# Altium schematic sheet 01.Driver&DispPanel.SchDoc
size A3
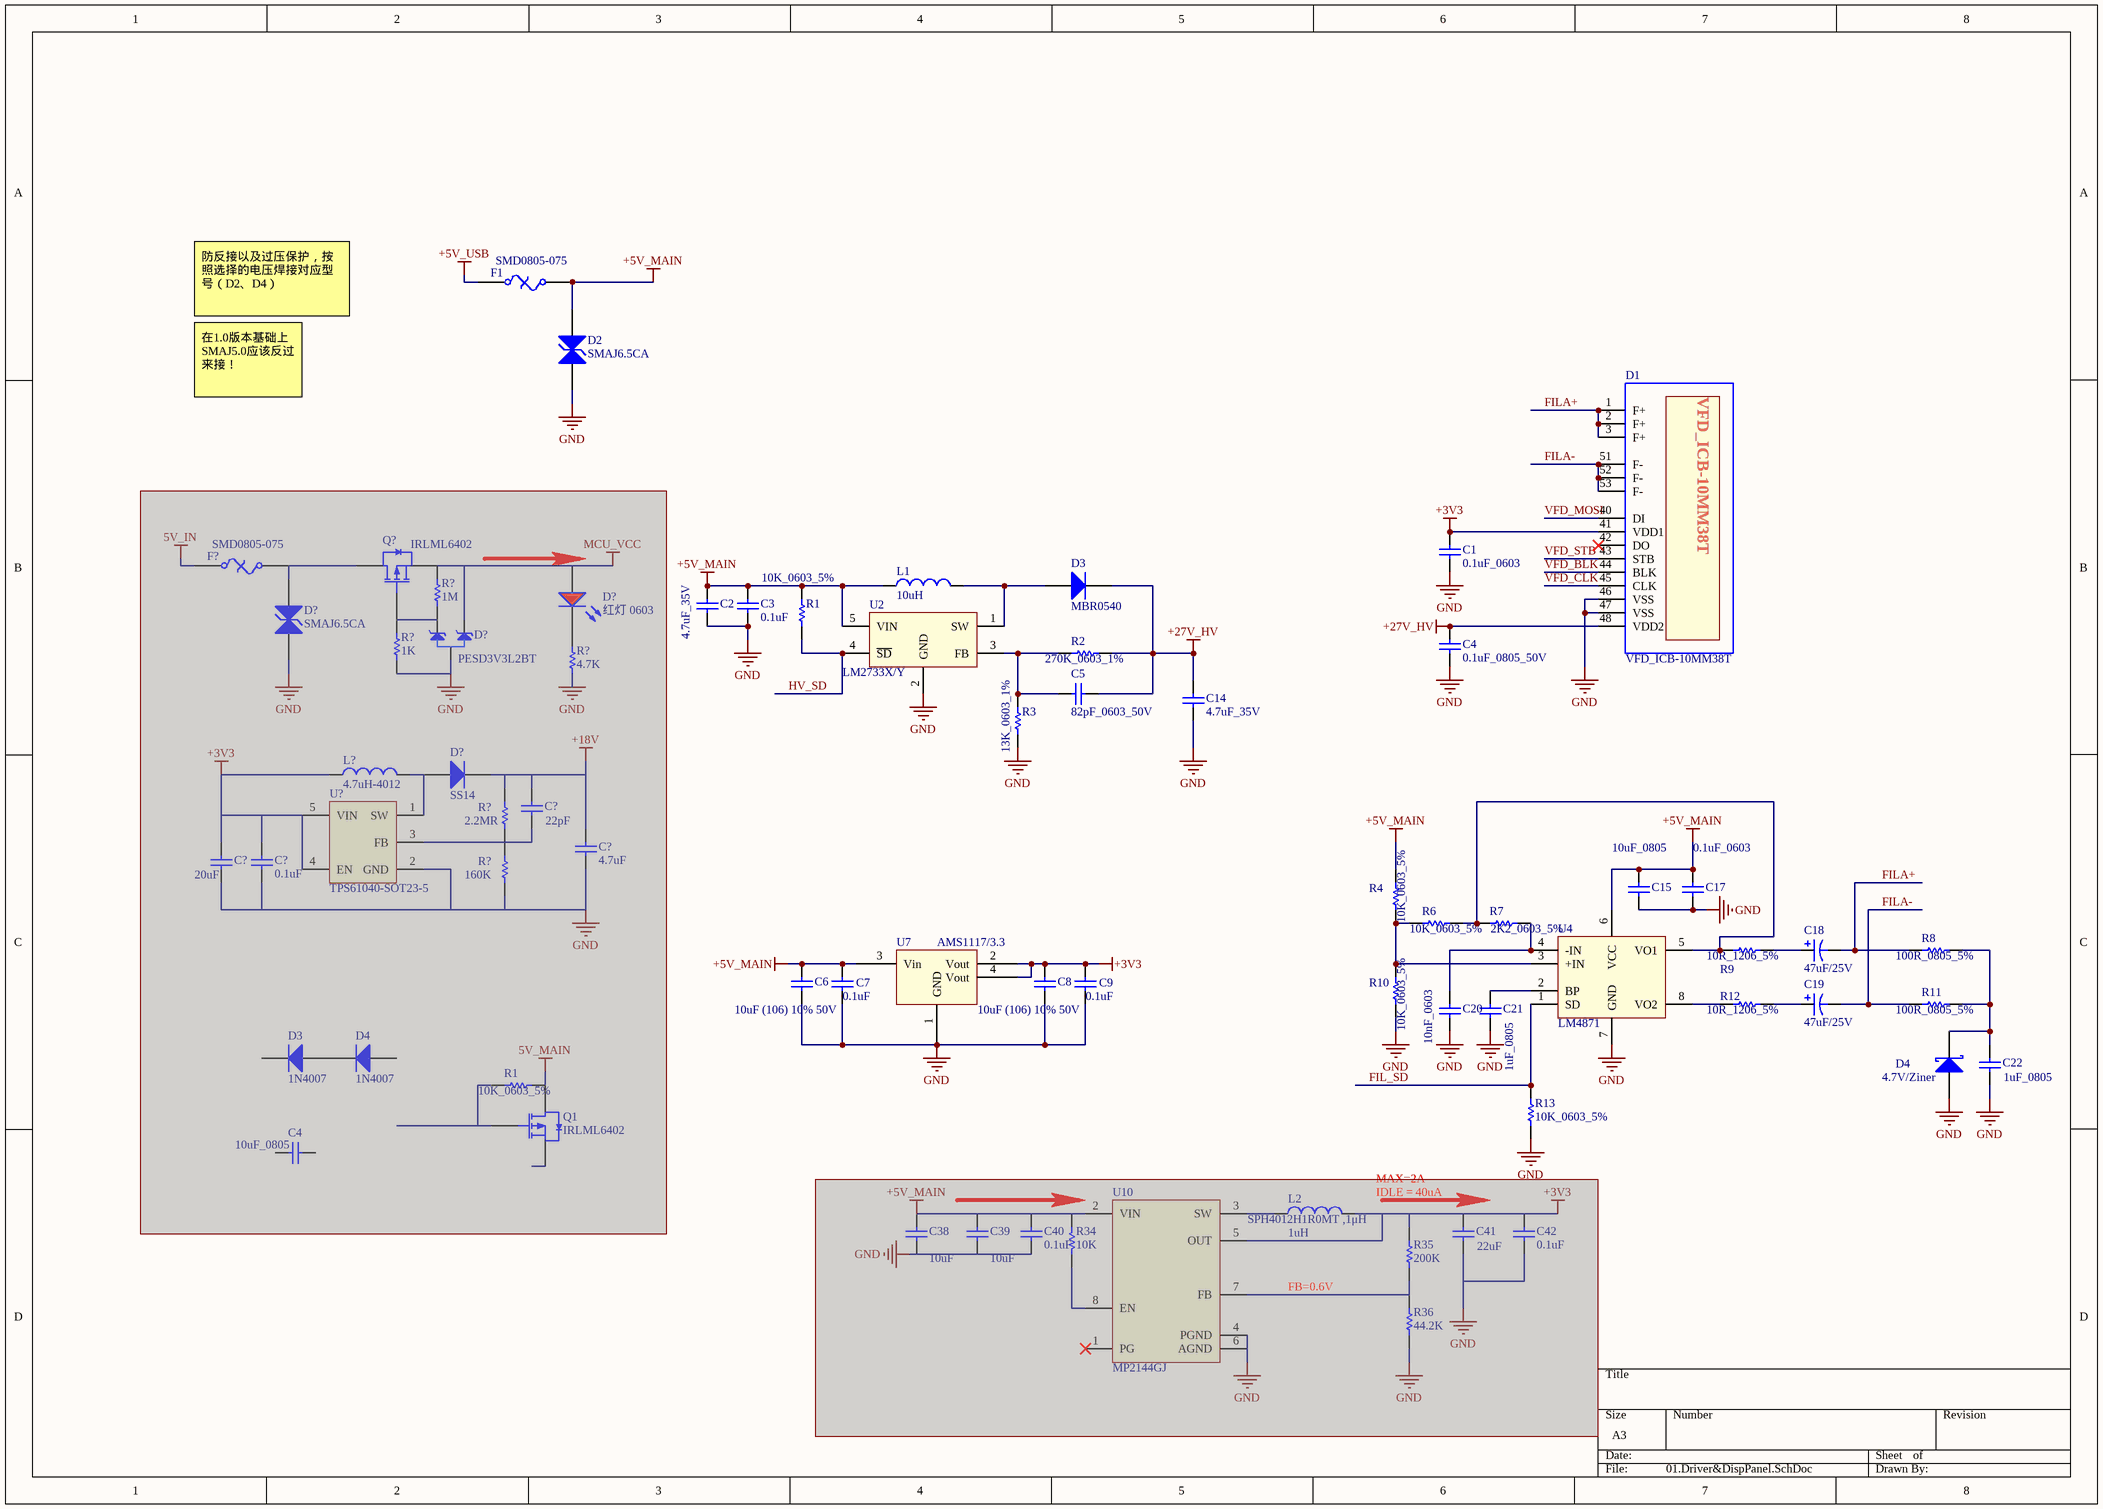
[diagram p0: 01.Driver&DispPanel.SchDoc]

## Parts
(Parts that share a designator on the sheet are numbered #1, #2 ... from top to bottom, then left to right.)
C1  0.1uF_0603  [LC-0603_C]
C2  4.7uF_35V  [LC-0805_C]
C3  0.1uF  [LC-0603_C]
C4#1  0.1uF_0805_50V  [LC-0805_C]
C4#2  10uF_0805  [LC-0603_C]  (masked out: inside a compile mask, not in the netlist)
C5  82pF_0603_50V  [LC-0603_C]
C6  10uF (106) 10% 50V  [LC-1206_C]
C7  value 0.1uF  [LC-0603_C]  (hidden comment: Cap Semi)
C8  10uF (106) 10% 50V  [LC-1206_C]
C9  value 0.1uF  [LC-0603_C]  (hidden comment: Cap Semi)
C14  4.7uF_35V  [LC-0805_C]
C15  10uF_0805  [LC-0805_C]
C17  0.1uF_0603  [LC-0603_C]
C18  47uF/25V  [CAPAE660X540N]
C19  47uF/25V  [CAPAE660X540N]
C20  10nF_0603  [LC-0603_C]
C21  1uF_0805  [LC-0805_C]
C22  1uF_0805  [LC-0805_C]
C38  value 10uF  [LC-0805_C]  (hidden comment: 10uF_0603)  (masked out: inside a compile mask, not in the netlist)
C39  value 10uF  [LC-0805_C]  (hidden comment: 10uF_0603)  (masked out: inside a compile mask, not in the netlist)
C40  value 0.1uF  [LC-0603_C]  (hidden comment: 0.1uF_0402)  (masked out: inside a compile mask, not in the netlist)
C41  value 22uF  [LC-1206_C]  (hidden comment: 10uF_0603)  (masked out: inside a compile mask, not in the netlist)
C42  value 0.1uF  [LC-0603_C]  (hidden comment: 0.1uF_0402)  (masked out: inside a compile mask, not in the netlist)
C?#1  22pF  [LC-0603_C]  (masked out: inside a compile mask, not in the netlist)
C?#2  20uF  [LC-1206_C]  (masked out: inside a compile mask, not in the netlist)
C?#3  4.7uF  [LC-0603_C]  (masked out: inside a compile mask, not in the netlist)
C?#4  0.1uF  [LC-0603_C]  (masked out: inside a compile mask, not in the netlist)
D1  VFD_ICB-10MM38T  [VFD_ICB-10MM38T]
D2  SMAJ6.5CA  [LC-SMA(DO-214AC)_S1]
D3#1  MBR0540  [LC-SOD-123]
D3#2  1N4007  [LC-SOD-123]  (masked out: inside a compile mask, not in the netlist)
D4#1  1N4007  [LC-SOD-123]  (masked out: inside a compile mask, not in the netlist)
D4#2  4.7V/Ziner  [LC-SMA(DO-214AC)_S1]
D?#1  红灯 0603  [LC-0603_LED_S1]  (masked out: inside a compile mask, not in the netlist)
D?#2  PESD3V3L2BT  [LC-SOT-23(SOT-23-3)]  (masked out: inside a compile mask, not in the netlist)
D?#3  SMAJ6.5CA  [LC-SMA(DO-214AC)_S1]  (masked out: inside a compile mask, not in the netlist)
D?#4  SS14  [LC-SOD-123]  (masked out: inside a compile mask, not in the netlist)
F1  SMD0805-075  [LC-0805_L]
F?  SMD0805-075  [LC-0805_L]  (masked out: inside a compile mask, not in the netlist)
L1  10uH  [VLS4012E]
L2  SPH4012H1R0MT ,1μH  value 1uH  [VLS4012E]  (masked out: inside a compile mask, not in the netlist)
L?  4.7uH-4012  [VLS4012E]  (masked out: inside a compile mask, not in the netlist)
Q1  IRLML6402  [LC-SOT-23-3L]  (masked out: inside a compile mask, not in the netlist)
Q?  IRLML6402  [LC-SOT-23-3L]  (masked out: inside a compile mask, not in the netlist)
R1#1  10K_0603_5%  [LC-0603_R]
R1#2  10K_0603_5%  [LC-0603_R]  (masked out: inside a compile mask, not in the netlist)
R2  270K_0603_1%  [LC-0603_R]
R3  13K_0603_1%  [LC-0603_R]
R4  10K_0603_5%  [LC-0603_R]
R6  10K_0603_5%  [LC-0603_R]
R7  2K2_0603_5%  [LC-0603_R]
R8  100R_0805_5%  [LC-0805_R]
R9  10R_1206_5%  [LC-1206_R]
R10  10K_0603_5%  [LC-0603_R]
R11  100R_0805_5%  [LC-0805_R]
R12  10R_1206_5%  [LC-1206_R]
R13  10K_0603_5%  [LC-0603_R]
R34  value 10K  [LC-0603_R]  (hidden comment: 10K_0402)  (masked out: inside a compile mask, not in the netlist)
R35  value 200K  [LC-0603_R]  (hidden comment: 200K_1%_0402)  (masked out: inside a compile mask, not in the netlist)
R36  value 44.2K  [LC-0603_R]  (hidden comment: 44.2K_1%_0402)  (masked out: inside a compile mask, not in the netlist)
R?#1  value 1M  [LC-0603_R]  (hidden comment: Res Semi)  (masked out: inside a compile mask, not in the netlist)
R?#2  value 1K  [LC-0603_R]  (hidden comment: Res Semi)  (masked out: inside a compile mask, not in the netlist)
R?#3  value 4.7K  [LC-0603_R]  (hidden comment: Res Semi)  (masked out: inside a compile mask, not in the netlist)
R?#4  value 2.2MR  [LC-0603_R]  (hidden comment: Res Semi)  (masked out: inside a compile mask, not in the netlist)
R?#5  value 160K  [LC-0603_R]  (hidden comment: Res Semi)  (masked out: inside a compile mask, not in the netlist)
U2  LM2733X/Y  [LC-SOT-23-5]
U4  LM4871
U7  AMS1117/3.3  [LC-SOT-223]
U10  MP2144GJ  [LC-TSOT-23-8]  (masked out: inside a compile mask, not in the netlist)
U?  TPS61040-SOT23-5  [LC-SOT-23-5]  (masked out: inside a compile mask, not in the netlist)

## Nets
+3V3: C1.2 C8.2 C9.2 D1.41(VDD1) U7.2(Vout) U7.4(Vout)
+5V_MAIN: C2.1 C3.2 C6.2 C7.2 C15.2 C17.2 D2.2(K) F1.2 L1.1 R1#1.2 R4.2 U2.5(VIN) U4.6(VCC) U7.3(Vin)
+5V_USB: F1.1
+27V_HV: C4#1.2 C5.1 C14.1 D1.48(VDD2) D3#1.2(K) R2.2
GND: C1.1 C2.2 C3.1 C4#1.1 C6.1 C7.1 C8.1 C9.1 C14.2 C15.1 C17.1 C20.1 C21.1 C22.1 D1.46(VSS) D1.47(VSS) D2.1(A) D4#2.1(A) R3.1 R10.1 R13.2 U2.2(GND) U4.7(GND) U7.1(GND)
FIL_SD: R13.1 U4.1(SD)
FILA+: C18.2 D1.1(F+) D1.2(F+) D1.3(F+) R8.2
FILA-: C19.2 D1.51(F-) D1.52(F-) D1.53(F-) R11.2
HV_SD: R1#1.1 U2.4(~{SD})
VFD_BLK: D1.44(BLK)
VFD_CLK: D1.45(CLK)
VFD_MOSI: D1.40(DI)
VFD_STB: D1.43(STB)
NetC5_2: C5.2 R2.1 R3.2 U2.3(FB)
NetC18_1: C18.1 R9.1
NetC19_1: C19.1 R12.1
NetC20_2: C20.2 R7.1 U4.4(-IN)
NetC21_2: C21.2 U4.2(BP)
NetC22_2: C22.2 D4#2.3(K) R8.1 R11.1
NetD3#1_1: D3#1.1(A) L1.2 U2.1(SW)
NetR4_1: R4.1 R6.2 R10.2 U4.3(+IN)
NetR6_1: R6.1 R7.2 R9.2 U4.5(VO1)
NetR12_2: R12.2 U4.8(VO2)

Not connected (* = marked no-connect by the designer): D1 42(DO)*

## Notes on the sheet
- 防反接以及过压保护，按照选择的电压焊接对应型号（D2、D4）
- 在1.0版本基础上 SMAJ5.0应该反过来接！
- MAX=2A
- IDLE＝40uA
- FB=0.6V

## Library data of the parts
C1 C2 C4#1 C4#2 C5 C14 C15 C17 C20-C22 C?#1-C?#3 = Cap: Capacitor; Value: 0.1uF; Published: 8-Jun-2000; LatestRevisionDate: 17-Jul-2002; LatestRevisionNote: Re-released for DXP Platform.; PackageReference: RAD-0.3; Publisher: Altium Limited; PackageDescription: Radial Cap, Thru-Hole; 2 Leads; 0.3 in Pin Spacing
C3 C38-C42 C?#4 = Cap: Capacitor; Published: 8-Jun-2000; LatestRevisionDate: 17-Jul-2002; LatestRevisionNote: Re-released for DXP Platform.; PackageReference: RAD-0.3; Publisher: Altium Limited; PackageDescription: Radial Cap, Thru-Hole; 2 Leads; 0.3 in Pin Spacing
  C3 C?#4: Value: 0.1uF
C6 C8 = 1206 10uF (106) 10% 50V: 贴片电容; ComponentLink1Description: 供应商链接; ComponentLink1URL: http://www.szlcsc.com/product/details_14236.html; Package: 1206; Supplier: LC; SuppliersPartNumber: C13585
C7 C9 = Cap Semi: Capacitor (Semiconductor SIM Model); Published: 8-Jun-2000; LatestRevisionDate: 29-May-2009; LatestRevisionNote: IPC-7351 Footprint Added.; PackageReference: C1206; Publisher: Altium Limited; PackageDescription: Chip Capacitor
C18 C19 = Cap Pol1: Polarized Capacitor (Radial); Value: 100pF; Published: 8-Jun-2000; LatestRevisionDate: 17-Jul-2002; LatestRevisionNote: Re-released for DXP Platform.; PackageReference: RB7.6-15; Publisher: Altium Limited; PackageDescription: Polarized Capacitor (Radial); 2 Leads
D2 D?#3 = SMB/DO-214AA P6SMB6.8CA: TVS; ComponentLink1Description: 供应商链接; ComponentLink1URL: http://www.szlcsc.com/product/details_79530.html; Package: SMB/DO-214AA; Supplier: LC; SuppliersPartNumber: C78395
D3#1 D3#2 D4#1 D?#4 = SOD-123 B5819W  SL: 肖特基二极管; ComponentLink1Description: 供应商链接; ComponentLink1URL: http://www.szlcsc.com/product/details_9093.html; Package: SOD-123; Supplier: LC; SuppliersPartNumber: C8598
D4#2 = Diode BAT17: pin to pad: 3>2; Note: Pin 2 is not connected and not drawn.; Published: 21-Mar-2003; LatestRevisionDate: 29-May-2009; LatestRevisionNote: IPC-7351 Footprint Added.; DatasheetVersion: Oct-1999; PackageVersion: Sep-2001; PackageReference: SOT-23; Publisher: Altium Limited; PackageDescription: 3-Pin SOT-23 Package 0.95 mm Pitch, 2.5 mm Lead Span; ComponentLink1Description: Manufacturer Link; ComponentLink1URL: http://www.infineon.com/; ComponentLink2Description: Datasheet; ComponentLink2URL: http://www.infineon.com/upload/Document/cmc_upload/documents/009/363/bat17series.pdf
D?#1 = 0603 红灯: 发光二极管; ComponentLink1Description: 供应商链接; ComponentLink1URL: http://www.szlcsc.com/product/details_2659.html; Package: 0603; Supplier: LC; SuppliersPartNumber: C2286
D?#2 = TVSx2
F1 F? = Fuse Thermal: Thermal Fuse; Published: 24-Mar-1999; LatestRevisionDate: 17-Jul-2002; LatestRevisionNote: Re-released for DXP Platform.; PackageReference: PIN-W2/E2.8; Publisher: Altium Limited; PackageDescription: Thru-Hole; 2 Leads
L1 L? = Inductor: Code_IEC: 1005; Value: 10mH; Published: 8-Jun-2000; LatestRevisionDate: 29-May-2009; LatestRevisionNote: IPC-7351 Footprint Added.; PackageReference: 0402-A; Publisher: Altium Limited; PackageDescription: Chip Inductor; Code_JEITA: 0402
L2 = Inductor: Code_IEC: 1005; Published: 8-Jun-2000; LatestRevisionDate: 29-May-2009; LatestRevisionNote: IPC-7351 Footprint Added.; PackageReference: 0402-A; Publisher: Altium Limited; PackageDescription: Chip Inductor; Code_JEITA: 0402
Q1 Q? = AO3401A P道沟 X13A15 SOT-23: MOS(场效应管); ComponentLink1Description: 供应商链接; ComponentLink1URL: http://www.szlcsc.com/product/details_15801.html; Package: SOT-23; Supplier: LC; SuppliersPartNumber: C15127
R1#1 R1#2 R2-R4 R6-R13 = Res Semi: Semiconductor Resistor; Value: 0; Published: 8-Jun-2000; LatestRevisionDate: 17-Jul-2002; LatestRevisionNote: Re-released for DXP Platform.; PackageReference: AXIAL-0.5; Publisher: Altium Limited; PackageDescription: Axial Device, Thru-Hole; 2 Leads; 0.5 in Pin Spacing
R34-R36 R?#1-R?#5 = Res Semi: Semiconductor Resistor; Published: 8-Jun-2000; LatestRevisionDate: 17-Jul-2002; LatestRevisionNote: Re-released for DXP Platform.; PackageReference: AXIAL-0.5; Publisher: Altium Limited; PackageDescription: Axial Device, Thru-Hole; 2 Leads; 0.5 in Pin Spacing
U2 = LM2733X
U7 = AMS1117: pin to pad: 4>2
U? = TPS61040